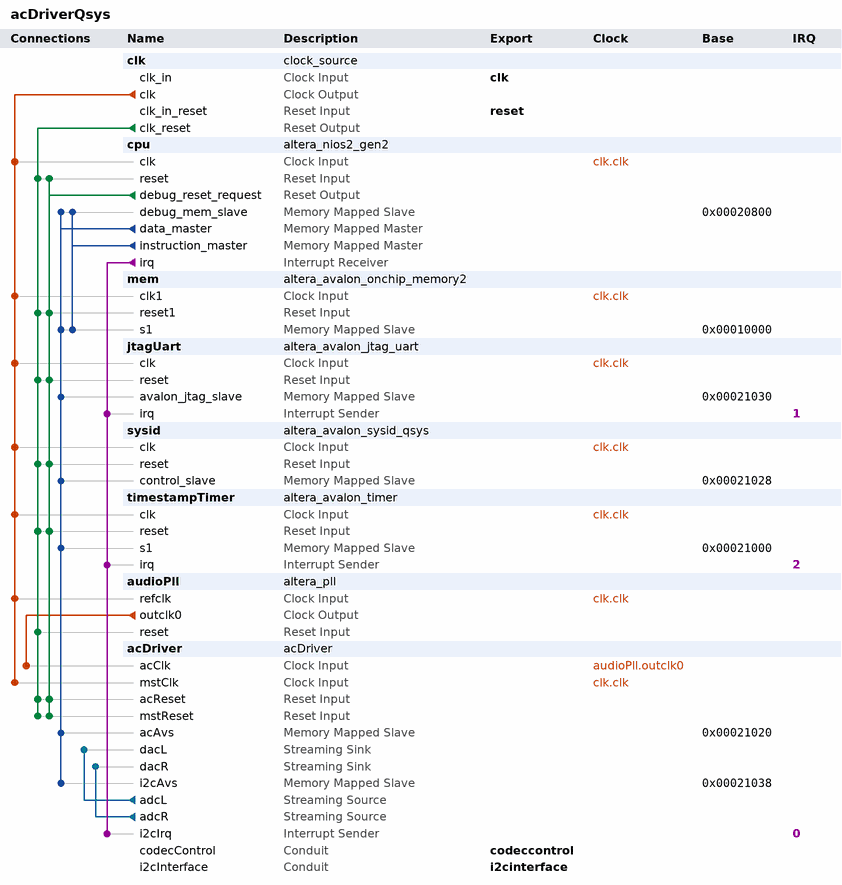
[diagram p0: system contents]
# Platform Designer (Qsys) system acDriverQsys, Cyclone V 5CSXFC6D6F31C8
# Parameters at their usual value, and those the tool derives, are not listed.
package require -exact qsys 15.1
create_system acDriverQsys
set_project_property DEVICE_FAMILY {Cyclone V}
set_project_property DEVICE 5CSXFC6D6F31C8

add_instance clk clock_source 15.1
set_instance_parameter_value clk clockFrequency 50000000

add_instance cpu altera_nios2_gen2 15.1
set_instance_parameter_value cpu dcache_size 0
set_instance_parameter_value cpu exceptionSlave mem.s1
set_instance_parameter_value cpu icache_size 2048
set_instance_parameter_value cpu impl Fast
set_instance_parameter_value cpu resetSlave mem.s1

add_instance mem altera_avalon_onchip_memory2 15.1
set_instance_parameter_value mem dataWidth 32
set_instance_parameter_value mem dualPort false
set_instance_parameter_value mem initMemContent true
set_instance_parameter_value mem initializationFileName onchip_mem.hex
set_instance_parameter_value mem memorySize 40960

add_instance jtagUart altera_avalon_jtag_uart 15.1
set_instance_parameter_value jtagUart simInteractiveOptions NO_INTERACTIVE_WINDOWS

add_instance sysid altera_avalon_sysid_qsys 15.1
set_instance_parameter_value sysid id 5465204

add_instance timestampTimer altera_avalon_timer 15.1
set_instance_parameter_value timestampTimer period 1
set_instance_parameter_value timestampTimer periodUnits MSEC

add_instance audioPll altera_pll 15.1
set_instance_parameter_value audioPll gui_actual_output_clock_frequency0 {12.287581 MHz}
set_instance_parameter_value audioPll gui_device_speed_grade 8
set_instance_parameter_value audioPll gui_number_of_clocks 1
set_instance_parameter_value audioPll gui_operation_mode direct
set_instance_parameter_value audioPll gui_output_clock_frequency0 12.287581
set_instance_parameter_value audioPll gui_pll_mode {Integer-N PLL}
set_instance_parameter_value audioPll gui_reference_clock_frequency 50.0
set_instance_parameter_value audioPll gui_use_locked false

add_instance acDriver acDriver 1.0
set_instance_parameter_value acDriver BCLK_DIVIDER 2
set_instance_parameter_value acDriver CLK_MASTER_FRQ 50000000
set_instance_parameter_value acDriver DATA_WDT 24
set_instance_parameter_value acDriver LRCK_DIVIDER 128
set_instance_parameter_value acDriver SCLK_I2C_FRQ 500000

# connections
add_connection audioPll.outclk0 acDriver.acClk clock
add_connection clk.clk acDriver.mstClk clock
add_connection clk.clk audioPll.refclk clock
add_connection clk.clk cpu.clk clock
add_connection clk.clk jtagUart.clk clock
add_connection clk.clk mem.clk1 clock
add_connection clk.clk sysid.clk clock
add_connection clk.clk timestampTimer.clk clock
add_connection clk.clk_reset acDriver.acReset reset
add_connection clk.clk_reset acDriver.mstReset reset
add_connection clk.clk_reset audioPll.reset reset
add_connection clk.clk_reset cpu.reset reset
add_connection clk.clk_reset jtagUart.reset reset
add_connection clk.clk_reset mem.reset1 reset
add_connection clk.clk_reset sysid.reset reset
add_connection clk.clk_reset timestampTimer.reset reset
add_connection cpu.debug_reset_request acDriver.acReset reset
add_connection cpu.debug_reset_request acDriver.mstReset reset
add_connection cpu.debug_reset_request cpu.reset reset
add_connection cpu.debug_reset_request jtagUart.reset reset
add_connection cpu.debug_reset_request mem.reset1 reset
add_connection cpu.debug_reset_request sysid.reset reset
add_connection cpu.debug_reset_request timestampTimer.reset reset
add_connection cpu.data_master acDriver.acAvs avalon
set_connection_parameter_value cpu.data_master/acDriver.acAvs baseAddress 0x00021020
add_connection cpu.data_master acDriver.i2cAvs avalon
set_connection_parameter_value cpu.data_master/acDriver.i2cAvs baseAddress 0x00021038
add_connection cpu.data_master cpu.debug_mem_slave avalon
set_connection_parameter_value cpu.data_master/cpu.debug_mem_slave baseAddress 0x00020800
add_connection cpu.data_master jtagUart.avalon_jtag_slave avalon
set_connection_parameter_value cpu.data_master/jtagUart.avalon_jtag_slave baseAddress 0x00021030
add_connection cpu.data_master mem.s1 avalon
set_connection_parameter_value cpu.data_master/mem.s1 baseAddress 0x00010000
add_connection cpu.data_master sysid.control_slave avalon
set_connection_parameter_value cpu.data_master/sysid.control_slave baseAddress 0x00021028
add_connection cpu.data_master timestampTimer.s1 avalon
set_connection_parameter_value cpu.data_master/timestampTimer.s1 baseAddress 0x00021000
add_connection cpu.instruction_master cpu.debug_mem_slave avalon
set_connection_parameter_value cpu.instruction_master/cpu.debug_mem_slave baseAddress 0x00020800
add_connection cpu.instruction_master mem.s1 avalon
set_connection_parameter_value cpu.instruction_master/mem.s1 baseAddress 0x00010000
add_connection acDriver.adcL acDriver.dacL avalon_streaming
add_connection acDriver.adcR acDriver.dacR avalon_streaming
add_connection cpu.irq acDriver.i2cIrq interrupt
set_connection_parameter_value cpu.irq/acDriver.i2cIrq irqNumber 0
add_connection cpu.irq jtagUart.irq interrupt
set_connection_parameter_value cpu.irq/jtagUart.irq irqNumber 1
add_connection cpu.irq timestampTimer.irq interrupt
set_connection_parameter_value cpu.irq/timestampTimer.irq irqNumber 2

# exported interfaces
add_interface clk clock sink
set_interface_property clk EXPORT_OF clk.clk_in
add_interface codeccontrol conduit end
set_interface_property codeccontrol EXPORT_OF acDriver.codecControl
add_interface i2cinterface conduit end
set_interface_property i2cinterface EXPORT_OF acDriver.i2cInterface
add_interface reset reset sink
set_interface_property reset EXPORT_OF clk.clk_in_reset

set_interconnect_requirement {$system} qsys_mm.clockCrossingAdapter HANDSHAKE
set_interconnect_requirement {$system} qsys_mm.enableEccProtection FALSE
set_interconnect_requirement {$system} qsys_mm.insertDefaultSlave FALSE
set_interconnect_requirement {$system} qsys_mm.maxAdditionalLatency 1

save_system acDriverQsys.qsys
